# EAGLE design STM32F446 front pane - northwest - v3 (EAGLE 9.6.2)
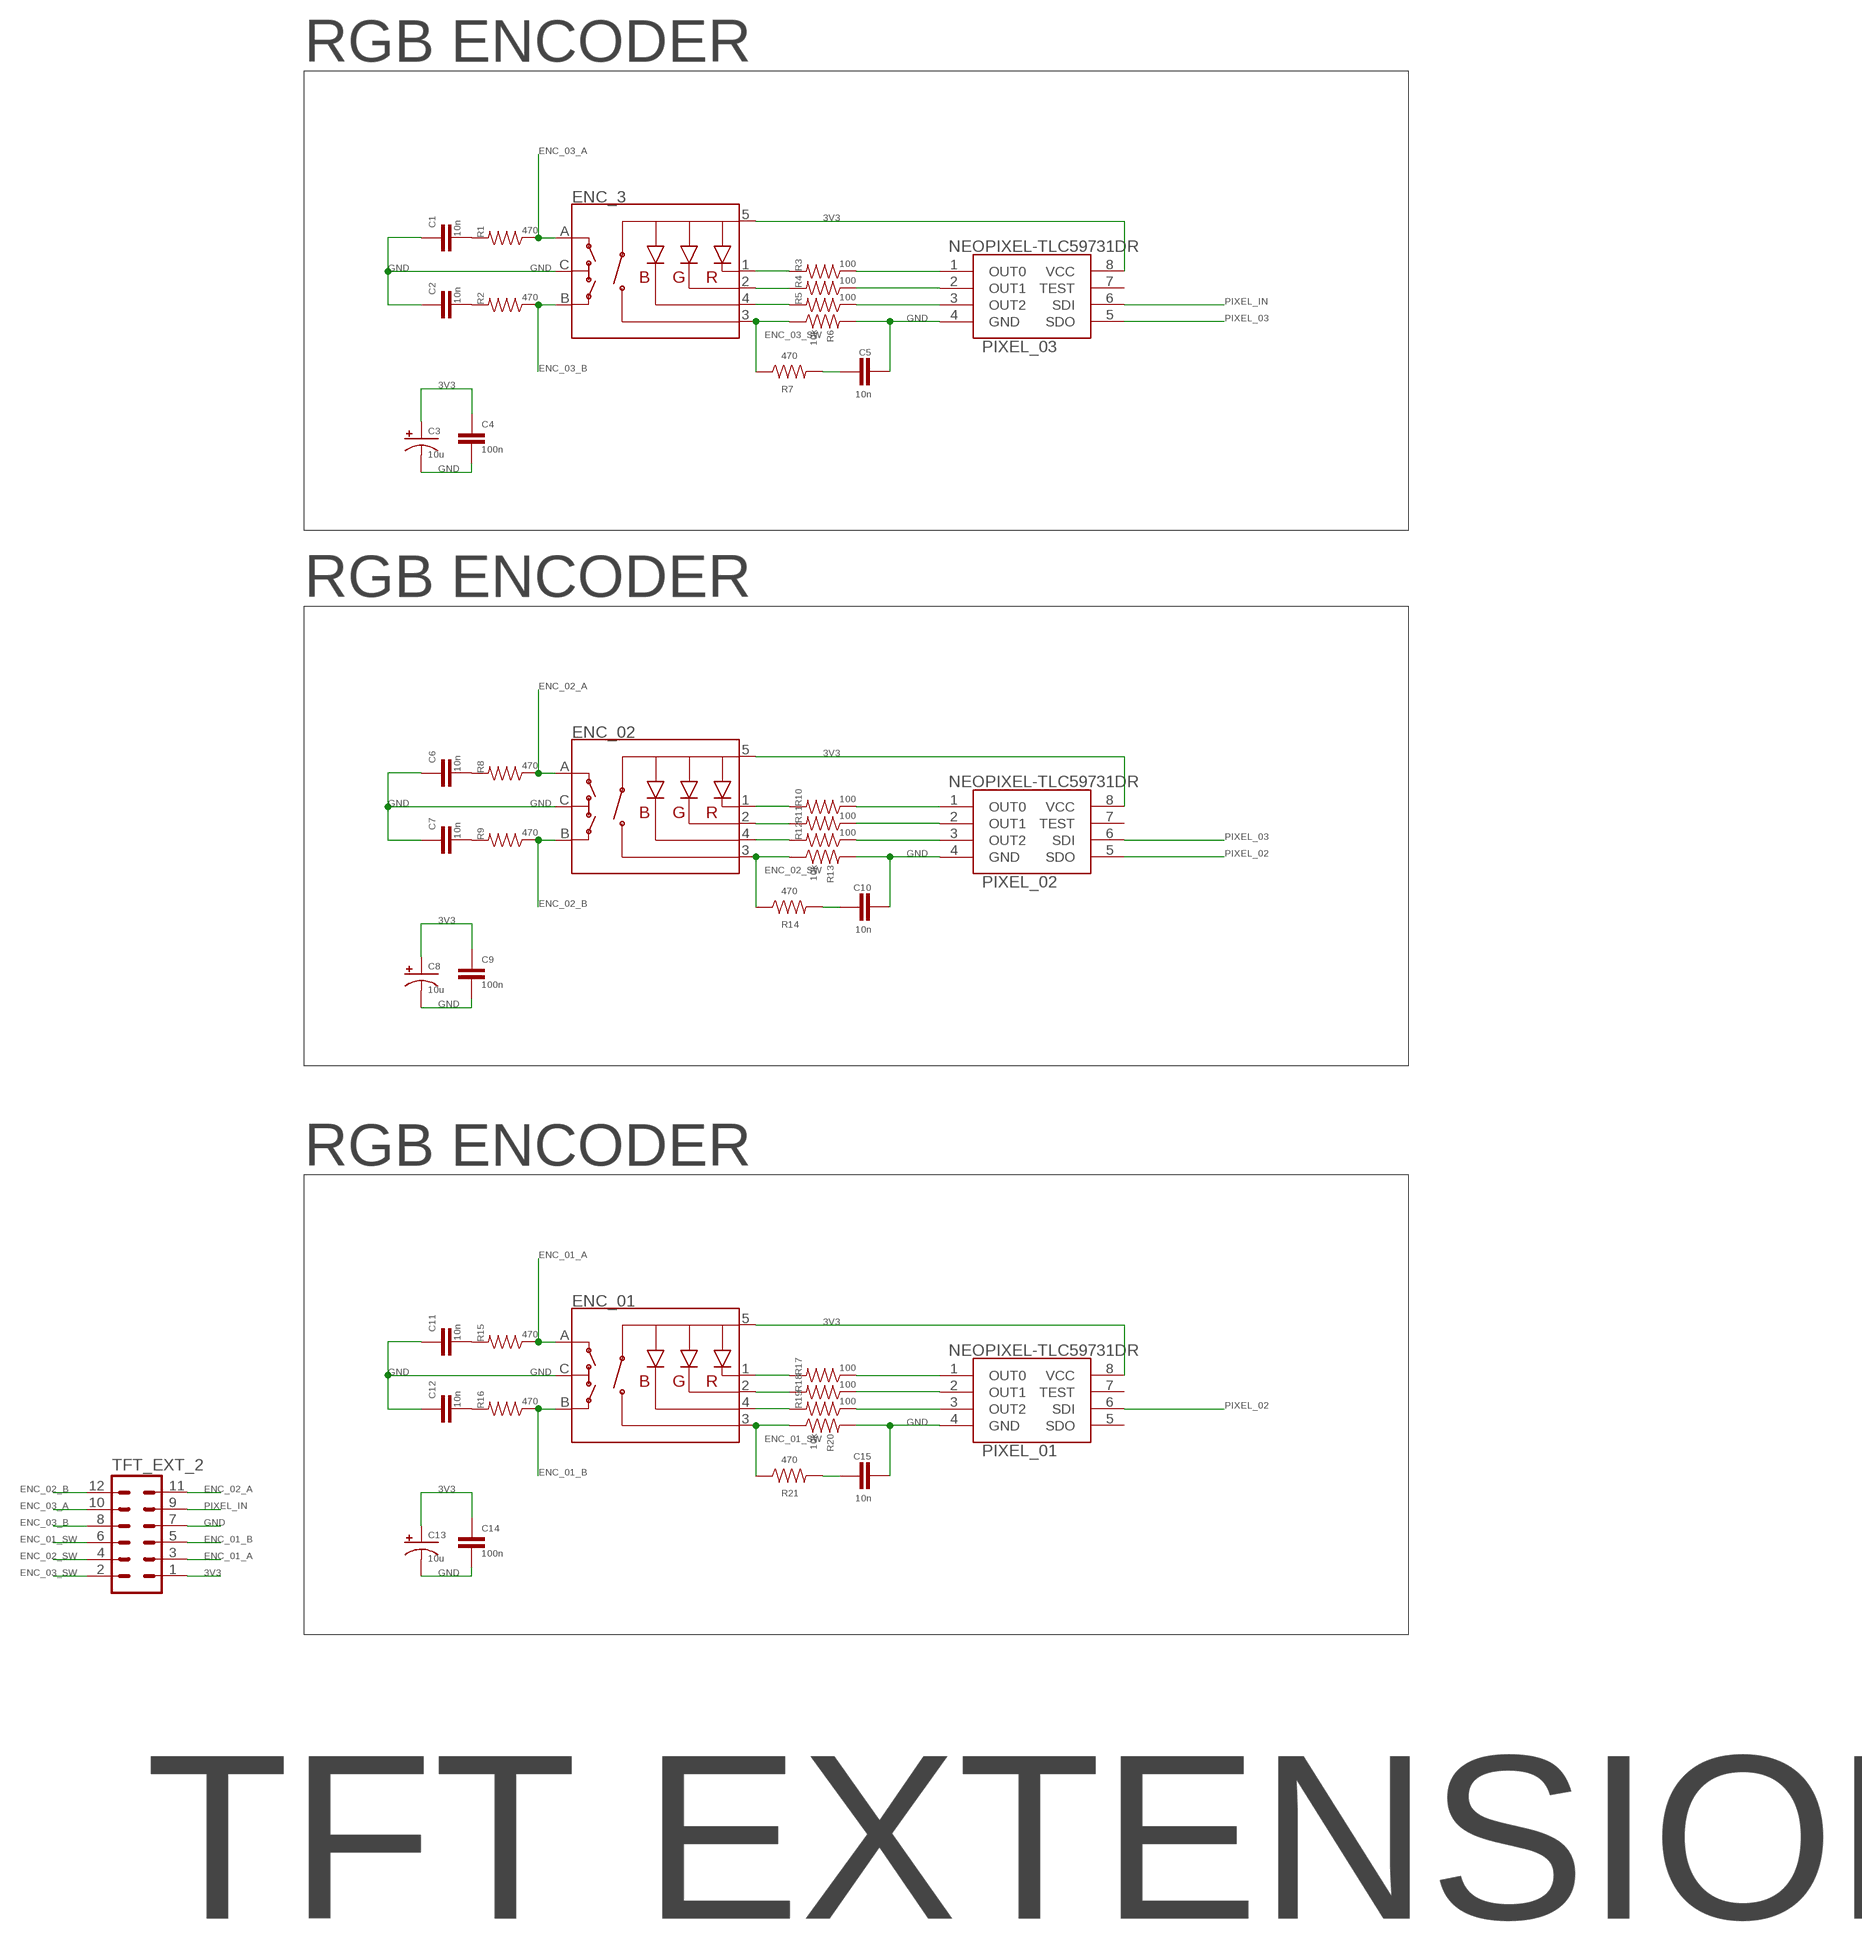
[diagram p0: schematic, sheet 1]

## Parts
C1  10n  PASSIF-CAP-0805  [0805-CAP]
C2  10n  PASSIF-CAP-0805  [0805-CAP]
C3  10u  PASSIF-CPOL-US2917  [CPOL2917]
C4  100n  PASSIF-CAP-0805  [0805-CAP]
C5  10n  PASSIF-CAP-0805  [0805-CAP]
C6  10n  PASSIF-CAP-0805  [0805-CAP]
C7  10n  PASSIF-CAP-0805  [0805-CAP]
C8  10u  PASSIF-CPOL-US2917  [CPOL2917]
C9  100n  PASSIF-CAP-0805  [0805-CAP]
C10  10n  PASSIF-CAP-0805  [0805-CAP]
C11  10n  PASSIF-CAP-0805  [0805-CAP]
C12  10n  PASSIF-CAP-0805  [0805-CAP]
C13  10u  PASSIF-CPOL-US2917  [CPOL2917]
C14  100n  PASSIF-CAP-0805  [0805-CAP]
C15  10n  PASSIF-CAP-0805  [0805-CAP]
ENC_01  ENCODER-RGB-SWITCH-NO_NUT  [ENCODER_LED_3]
ENC_02  ENCODER-RGB-SWITCH-NO_NUT  [ENCODER_LED_3]
ENC_3  ENCODER-RGB-SWITCH-NO_NUT  [ENCODER_LED_3]
PIXEL_01  NEOPIXEL-TLC59731DR  [SOIC127P600X175-8N]
PIXEL_02  NEOPIXEL-TLC59731DR  [SOIC127P600X175-8N]
PIXEL_03  NEOPIXEL-TLC59731DR  [SOIC127P600X175-8N]
R1  470  PASSIF-RESISTOR-1206  [1206]
R2  470  PASSIF-RESISTOR-1206  [1206]
R3  100  PASSIF-RESISTOR-1206  [1206]
R4  100  PASSIF-RESISTOR-1206  [1206]
R5  100  PASSIF-RESISTOR-1206  [1206]
R6  10k  PASSIF-RESISTOR-1206  [1206]
R7  470  PASSIF-RESISTOR-1206  [1206]
R8  470  PASSIF-RESISTOR-1206  [1206]
R9  470  PASSIF-RESISTOR-1206  [1206]
R10  100  PASSIF-RESISTOR-1206  [1206]
R11  100  PASSIF-RESISTOR-1206  [1206]
R12  100  PASSIF-RESISTOR-1206  [1206]
R13  10k  PASSIF-RESISTOR-1206  [1206]
R14  470  PASSIF-RESISTOR-1206  [1206]
R15  470  PASSIF-RESISTOR-1206  [1206]
R16  470  PASSIF-RESISTOR-1206  [1206]
R17  100  PASSIF-RESISTOR-1206  [1206]
R18  100  PASSIF-RESISTOR-1206  [1206]
R19  100  PASSIF-RESISTOR-1206  [1206]
R20  10k  PASSIF-RESISTOR-1206  [1206]
R21  470  PASSIF-RESISTOR-1206  [1206]
TFT_EXT_2  MA06-2  [MA06-2]

## Nets
3V3: C3.+ C4.1 C8.+ C9.1 C13.+ C14.1 ENC_01.5(+) ENC_02.5(+) ENC_3.5(+) PIXEL_01.8(VCC) PIXEL_02.8(VCC) PIXEL_03.8(VCC) TFT_EXT_2.1
ENC_01_A: ENC_01.A R15.1 TFT_EXT_2.3
ENC_01_B: ENC_01.B R16.1 TFT_EXT_2.5
ENC_01_SW: ENC_01.3(SW) R20.1 R21.1 TFT_EXT_2.6
ENC_02_A: ENC_02.A R8.1 TFT_EXT_2.11
ENC_02_B: ENC_02.B R9.1 TFT_EXT_2.12
ENC_02_SW: ENC_02.3(SW) R13.1 R14.1 TFT_EXT_2.4
ENC_03_A: ENC_3.A R1.1 TFT_EXT_2.10
ENC_03_B: ENC_3.B R2.1 TFT_EXT_2.8
ENC_03_SW: ENC_3.3(SW) R6.1 R7.1 TFT_EXT_2.2
GND: C1.1 C2.1 C3.- C4.2 C5.2 C6.1 C7.1 C8.- C9.2 C10.2 C11.1 C12.1 C13.- C14.2 C15.2 ENC_01.C ENC_02.C ENC_3.C PIXEL_01.4(GND) PIXEL_02.4(GND) PIXEL_03.4(GND) R6.2 R13.2 R20.2 TFT_EXT_2.7
N$9808: ENC_01.1(-R) R17.2
N$9809: ENC_01.2(-G) R18.2
N$9810: ENC_01.4(-B) R19.2
N$9811: PIXEL_01.1(OUT0) R17.1
N$9812: PIXEL_01.2(OUT1) R18.1
N$9813: PIXEL_01.3(OUT2) R19.1
N$9814: C11.2 R15.2
N$9815: C12.2 R16.2
N$9816: C15.1 R21.2
N$10174: ENC_02.1(-R) R10.2
N$10175: ENC_02.2(-G) R11.2
N$10176: ENC_02.4(-B) R12.2
N$10177: PIXEL_02.1(OUT0) R10.1
N$10178: PIXEL_02.2(OUT1) R11.1
N$10179: PIXEL_02.3(OUT2) R12.1
N$10180: C6.2 R8.2
N$10181: C7.2 R9.2
N$10182: C10.1 R14.2
N$10540: ENC_3.1(-R) R3.2
N$10541: ENC_3.2(-G) R4.2
N$10542: ENC_3.4(-B) R5.2
N$10543: PIXEL_03.1(OUT0) R3.1
N$10544: PIXEL_03.2(OUT1) R4.1
N$10545: PIXEL_03.3(OUT2) R5.1
N$10546: C1.2 R1.2
N$10547: C2.2 R2.2
N$10548: C5.1 R7.2
PIXEL_02: PIXEL_01.6(SDI) PIXEL_02.5(SDO)
PIXEL_03: PIXEL_02.6(SDI) PIXEL_03.5(SDO)
PIXEL_IN: PIXEL_03.6(SDI) TFT_EXT_2.9
Unconnected: PIXEL_01.5(SDO) PIXEL_01.7(TEST) PIXEL_02.7(TEST) PIXEL_03.7(TEST)

## Notes on the sheet
- RGB ENCODER
- RGB ENCODER
- RGB ENCODER
- TFT EXTENSION

## Library data of the parts
C1 C2 C4-C7 C9-C12 C14 C15 = stock-perso:PASSIF-CAP
C3 C8 C13 = stock-perso:PASSIF-CPOL-US: SMT Tantalum Capacitor; MOUSER: 581-TPSE477K010R0200
ENC_01 ENC_02 ENC_3 = stock-perso:ENCODER-RGB-SWITCH: Illuminated Rotary Encoder w/ RGB LED and select switch Encoders rotate similarly to potentiometers, but they’re different from potentiometers in that an encoder has full rotation without limits. They output gray code so that you can tell how much and in which direction the encoder has been turned. This encoder includes an RGB LED and a push-down select switch. Part #: Top Up EC12PLRGBSDVBF-D <http://top-up.so-buy.com/front/bin/ptdetail.phtml?Part=EC12PLRGBSDVBF-D> SparkFun Products Rotary Encoder - Illuminated (RGB) <https://www.sparkfun.com/products/10982> (COM-10982); PROD_ID: RES-14168
PIXEL_01-PIXEL_03 = stock-perso:NEOPIXEL-TLC59731DR: 3-Channel, 8-Bit, PWM LED Driver with Single-Wire Interface (similaire à du neopixel) Source: Datasheet <http://www.ti.com/lit/gpn/tlc59731>; ARROW_PART_NUMBER: TLC59731DR; ARROW_PRICE-STOCK: https://www.arrow.com/en/products/tlc59731dr/texas-instruments; DESCRIPTION: 3-Channel, 8-Bit, PWM LED Driver with Single-Wire Interface; HEIGHT: 1.75mm; MANUFACTURER_NAME: Texas Instruments; MANUFACTURER_PART_NUMBER: TLC59731DR; MOUSER_PART_NUMBER: 595-TLC59731DR; MOUSER_PRICE-STOCK: https://www.mouser.co.uk/ProductDetail/Texas-Instruments/TLC59731DR?qs=s44pgLhgXQgiW%2FpyLmUsDA%3D%3D
R1-R21 = stock-perso:PASSIF-RESISTOR
TFT_EXT_2 = con-lstb:MA06-2: PIN HEADER; OC_FARNELL: unknown; OC_NEWARK: unknown

## Board
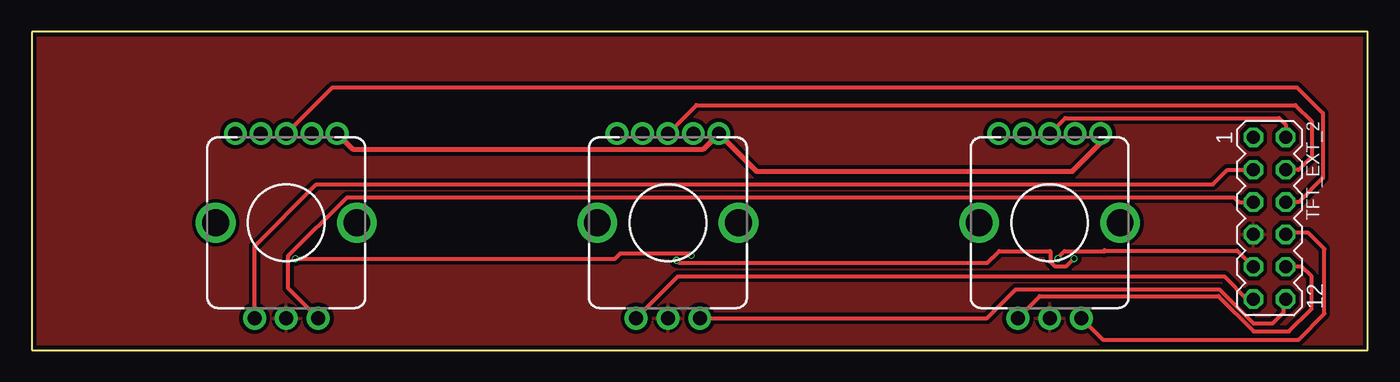
[diagram p1: board, top side]
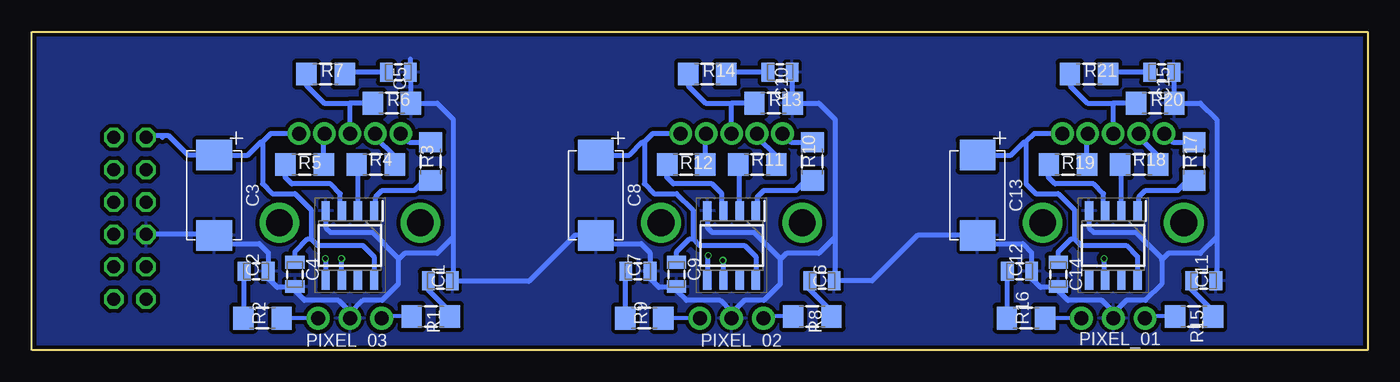
[diagram p2: board, bottom side, seen from below]

Size 105 x 25 mm. Coordinates in mm from the lower left corner, seen from the top.
Outline: 0,0 105,0 105,25 0,25 0,0
Copper layers (1*16): Top 0.035559375mm / dielectric 1.6mm / Bottom 0.035559375mm
Design rules "jlcpcb2layer": minimum track width 5mil, minimum drill 12mil, track to track 5mil, track to pad 5mil, pad to pad 5mil, via to via 5mil, smd to smd 5mil, copper to edge 8mil, drill to drill 6mil, minimum pad ring 5mil, minimum via ring 3mil, stop-mask expansion 2.5mil, vias tented up to drill 0mil, thermal gap 10mil

### Footprints (pad centres in the part's own frame; a part is rotated, then mirrored left to right if it is on the bottom)
0805-CAP = smd 1 x 1.5: 1 -0.95,0; 2 0.95,0
CPOL2917 = smd 2.4 x 2.8: + -3.15,0; - 3.15,0
ENCODER_LED_3 = drill 1.1 pad 1.778: 1 -4,7; 2 -2,7; 3 0,7; 4 2,7; 5 4,7 | drill 1.1 pad 1.8: A -2.5,-7.5; B 2.5,-7.5; C 0,-7.5 | drill 2.1: M1 -5.55,0; M2 5.55,0
SOIC127P600X175-8N = smd 1.528 x 0.65: 1 -2.711,1.905; 2 -2.711,0.635; 3 -2.711,-0.635; 4 -2.711,-1.905; 5 2.711,-1.905; 6 2.711,-0.635; 7 2.711,0.635; 8 2.711,1.905
1206 = smd 1.6 x 1.8: 1 -1.5,0; 2 1.5,0
MA06-2 = drill 1.016 octagon: 1 -6.35,-1.27; 2 -6.35,1.27; 3 -3.81,-1.27; 4 -3.81,1.27; 5 -1.27,-1.27; 6 -1.27,1.27; 7 1.27,-1.27; 8 1.27,1.27; 9 3.81,-1.27; 10 3.81,1.27; 11 6.35,-1.27; 12 6.35,1.27

### Placement (x,y rotation side)
C1  72.89,5.43 180 bottom
C2  87.37,6.19 180 bottom
C3  90.67,12.16 270 bottom
C4  84.32,5.94 270 bottom
C5  76.19,21.81 0 bottom
C6  42.89,5.43 180 bottom
C7  57.37,6.19 180 bottom
C8  60.67,12.16 270 bottom
C9  54.32,5.94 270 bottom
C10  46.19,21.81 0 bottom
C11  12.89,5.43 180 bottom
C12  27.37,6.19 180 bottom
C13  30.67,12.16 270 bottom
C14  24.32,5.94 270 bottom
C15  16.19,21.81 0 bottom
ENC_01  20,10 0 top
ENC_02  50,10 0 top
ENC_3  80,10 0 top
PIXEL_01  20,8.22 270 bottom
PIXEL_02  50,8.22 270 bottom
PIXEL_03  80,8.22 270 bottom
R1  73.65,2.63 0 bottom
R2  86.86,2.51 180 bottom
R3  73.65,14.83 90 bottom
R4  77.97,14.57 0 bottom
R5  83.56,14.57 0 bottom
R6  76.7,19.4 0 bottom
R7  81.91,21.68 0 bottom
R8  43.65,2.63 0 bottom
R9  56.86,2.51 180 bottom
R10  43.65,14.83 90 bottom
R11  47.97,14.57 0 bottom
R12  53.56,14.57 0 bottom
R13  46.7,19.4 0 bottom
R14  51.91,21.68 0 bottom
R15  13.65,2.63 0 bottom
R16  26.86,2.51 180 bottom
R17  13.65,14.83 90 bottom
R18  17.97,14.57 0 bottom
R19  23.56,14.57 0 bottom
R20  16.7,19.4 0 bottom
R21  21.91,21.68 0 bottom
TFT_EXT_2  97.29,10.35 270 top

### Tracks (layer width: path | path; a pad name or v marks a point on that pad's centre or on a via)
3V3
  Top 0.406: ENC_3.5 84,16.24 81.79,14.03 56.97,14.03 ENC_02.5 52.78,15.78 25.22,15.78 ENC_01.5
  Bottom 0.406: ENC_01.5 26.21,17 26.86,16.35 | 26.86,16.35 26.86,13.05 26.1,12.29 24.32,12.29 23.05,11.02 23.05,8.73 | 23.05,8.73 22.54,8.22 18.98,8.22 18.09,7.33 PIXEL_01.8 | C14.1 24.32,7.71 23.3,8.73 23.05,8.73 | C13.+ 28.03,15.31 26.98,16.35 26.86,16.35 | ENC_02.5 56.21,17 56.86,16.35 | 56.86,16.35 56.86,13.05 56.1,12.29 54.32,12.29 53.05,11.02 53.05,8.73 | 53.05,8.73 52.54,8.22 48.98,8.22 48.09,7.33 PIXEL_02.8 | C9.1 54.32,7.71 53.3,8.73 53.05,8.73 | C8.+ 58.03,15.31 56.98,16.35 56.86,16.35 | ENC_3.5 86.21,17 86.86,16.35 | 86.86,16.35 86.86,13.05 86.1,12.29 84.32,12.29 83.05,11.02 83.05,8.73 | 83.05,8.73 82.54,8.22 78.98,8.22 78.09,7.33 PIXEL_03.8 | C4.1 84.32,7.71 83.3,8.73 83.05,8.73 | 86.86,16.35 86.98,16.35 88.03,15.31 C3.+ 92.72,15.31 94.24,16.83 94.62,16.83 | 94.62,16.83 94.75,16.7 | 94.62,16.83 95.89,16.83 TFT_EXT_2.1
ENC_01_A
  Top 0.305: ENC_01.A 17.5,8.16 22.36,13.02 92.84,13.02 93.98,14.16 TFT_EXT_2.3
  Bottom 0.305: R15.1 17.37,2.63 ENC_01.A
ENC_01_B
  Top 0.305: ENC_01.B 20.16,4.84 20.16,7.4 24.77,12 94.49,12 94.87,11.62 TFT_EXT_2.5
  Bottom 0.305: ENC_01.B R16.1
ENC_01_SW
  Top 0.305: ENC_01.3 23.64,20.64 99.45,20.64 101.48,18.61 101.48,13.53 99.57,11.62 TFT_EXT_2.6
  Bottom 0.305: R21.1 23.41,20.77
  Bottom 0.406: ENC_01.3 20,19.4 | R20.1 20,19.4 | 20,19.4 22.03,19.4 23.41,20.77
ENC_02_A
  Top 0.305: ENC_02.A 50.78,5.78 93.73,5.78 95.51,4 TFT_EXT_2.11
  Bottom 0.305: R8.1 47.37,2.63 ENC_02.A
ENC_02_B
  Top 0.305: ENC_02.B 75.09,2.5 77.35,4.76 93.35,4.76 96.02,2.1 97.54,2.1 98.41,2.96 98.41,3.85 TFT_EXT_2.12
  Bottom 0.305: ENC_02.B R9.1
ENC_02_SW
  Top 0.305: ENC_02.3 52.24,19.24 99.32,19.24 100.59,17.97 100.59,15.18 99.57,14.16 TFT_EXT_2.4
  Bottom 0.305: R14.1 53.41,20.77
  Bottom 0.406: ENC_02.3 50,19.4 | R13.1 50,19.4 | 50,19.4 52.03,19.4 53.41,20.77
ENC_03_A
  Top 0.305: ENC_3.A 79.23,4.23 93.27,4.23 96.04,1.46 98.81,1.46 100.59,3.24 100.59,5.78 99.83,6.54 TFT_EXT_2.10
  Bottom 0.305: R1.1 77.37,2.63 ENC_3.A
ENC_03_B
  Top 0.305: ENC_3.B 84.17,0.82 99.57,0.82 101.61,2.86 101.61,7.94 100.33,9.21 98.68,9.21 TFT_EXT_2.8
  Bottom 0.305: ENC_3.B R2.1
ENC_03_SW
  Top 0.305: ENC_3.3 81.22,18.22 98.05,18.22 98.56,17.72 TFT_EXT_2.2
  Bottom 0.305: R7.1 83.41,20.77
  Bottom 0.406: ENC_3.3 80,19.4 | R6.1 80,19.4 | 80,19.4 82.03,19.4 83.41,20.77
GND
  Bottom 0.406: PIXEL_01.4 21.91,9.62 21.52,9.24 18.22,9.24 16.19,7.21 16.19,7.08 | 16.19,7.08 16.19,5.17 17.46,3.9 18.98,3.9 20,2.89 ENC_01.C 20,3.02 20.89,3.9 23.56,3.9 24.32,4.67 C14.2 24.38,4.92 25.71,4.92 26.42,5.62 C12.1 26.42,7.65 27.11,8.35 30.01,8.35 C13.- 35.38,9.01 38.96,5.43 C6.1 41.87,5.49 41.87,8.86 | 15.2,20.18 15.2,19.91 | 15.2,19.91 R20.2 13.14,19.4 11.87,18.13 11.87,8.86 | C11.1 11.87,5.49 11.87,8.86 | 11.87,8.86 13.14,7.59 15.68,7.59 16.19,7.08 | C15.2 15.24,19.95 15.2,19.91 | PIXEL_02.4 51.91,9.62 51.52,9.24 48.22,9.24 46.19,7.21 46.19,7.08 | 46.19,7.08 46.19,5.17 47.46,3.9 48.98,3.9 50,2.89 ENC_02.C 50,3.02 50.89,3.9 53.56,3.9 54.32,4.67 C9.2 54.38,4.92 55.72,4.92 56.42,5.62 C7.1 56.42,7.65 57.11,8.35 60.01,8.35 C8.- 62.31,9.01 65.92,5.4 71.78,5.4 71.87,5.49 | 45.2,20.18 45.2,19.91 | 45.2,19.91 R13.2 43.14,19.4 41.87,18.13 41.87,8.86 | 41.87,8.86 43.14,7.59 45.68,7.59 46.19,7.08 | C10.2 45.24,19.95 45.2,19.91 | PIXEL_03.4 81.91,9.62 81.52,9.24 78.22,9.24 76.19,7.21 76.19,7.08 | 76.19,7.08 76.19,5.17 77.46,3.9 78.98,3.9 80,2.89 ENC_3.C 80,3.02 80.89,3.9 83.56,3.9 84.32,4.67 C4.2 84.38,4.92 85.72,4.92 86.42,5.62 C2.1 86.42,7.65 87.11,8.35 90.01,8.35 C3.- 90.74,9.08 TFT_EXT_2.7 | 75.2,20.18 75.2,19.91 | 75.2,19.91 R6.2 73.14,19.4 71.87,18.13 71.87,8.86 | 71.87,5.49 C1.1 | 71.87,8.86 71.87,5.49 | 71.87,8.86 73.14,7.59 75.68,7.59 76.19,7.08 | 75.2,19.91 75.24,19.95 C5.2 75.24,22.85
  pour Top (isolate 0.305): 0,25 105,25 105,0 0,0
  pour Bottom (isolate 0.305): 0,25 105,25 105,0 0,0
N$9808
  Bottom 0.406: ENC_01.1 15.33,16.33 R17.2
N$9809
  Bottom 0.406: ENC_01.2 18,16.76 16.44,15.21 16.44,14.6 R18.2
N$9810
  Bottom 0.406: R19.2 22.06,16.94 ENC_01.4
N$9811
  Bottom 0.406: PIXEL_01.1 17.97,11.06 17.97,12.03 17.46,12.54 14.92,12.54 14.13,13.33 R17.1
N$9812
  Bottom 0.406: PIXEL_01.2 19.37,14.47 R18.1
N$9813
  Bottom 0.406: PIXEL_01.3 20.76,11.06 20.76,12.29 21.52,13.05 24.57,13.05 25.08,13.56 25.08,14.55 R19.1
N$9814
  Bottom 0.305: C11.2 13.84,4.73 | 12.15,3.04 R15.2
  Bottom 0.406: 13.84,4.73 12.15,3.04
N$9815
  Bottom 0.305: C12.2 28.36,6.15
  Bottom 0.406: 28.36,6.15 R16.2
N$9816
  Bottom 0.305: 20.28,21.81 R21.2
  Bottom 0.406: C15.1 20.28,21.81
N$10174
  Bottom 0.406: ENC_02.1 45.33,16.33 R10.2
N$10175
  Bottom 0.406: ENC_02.2 48,16.76 46.44,15.21 46.44,14.6 R11.2
N$10176
  Bottom 0.406: R12.2 52.06,16.94 ENC_02.4
N$10177
  Bottom 0.406: PIXEL_02.1 47.97,11.06 47.97,12.03 47.46,12.54 44.92,12.54 44.13,13.33 R10.1
N$10178
  Bottom 0.406: PIXEL_02.2 49.37,14.47 R11.1
N$10179
  Bottom 0.406: PIXEL_02.3 50.76,11.06 50.76,12.29 51.52,13.05 54.57,13.05 55.08,13.56 55.08,14.55 R12.1
N$10180
  Bottom 0.305: C6.2 43.84,4.73 | 42.15,3.04 R8.2
  Bottom 0.406: 43.84,4.73 42.15,3.04
N$10181
  Bottom 0.305: C7.2 58.36,6.15
  Bottom 0.406: 58.36,6.15 R9.2
N$10182
  Bottom 0.305: 50.28,21.81 R14.2
  Bottom 0.406: C10.1 50.28,21.81
N$10540
  Bottom 0.406: ENC_3.1 75.33,16.33 R3.2
N$10541
  Bottom 0.406: ENC_3.2 78,16.76 76.44,15.21 76.44,14.6 R4.2
N$10542
  Bottom 0.406: R5.2 82.06,16.94 ENC_3.4
N$10543
  Bottom 0.406: PIXEL_03.1 77.97,11.06 77.97,12.03 77.46,12.54 74.92,12.54 74.13,13.33 R3.1
N$10544
  Bottom 0.406: PIXEL_03.2 79.36,14.47 R4.1
N$10545
  Bottom 0.406: PIXEL_03.3 80.76,11.06 80.76,12.29 81.52,13.05 84.57,13.05 85.08,13.56 85.08,14.55 R5.1
N$10546
  Bottom 0.305: C1.2 73.84,4.73 | 72.15,3.04 R1.2
  Bottom 0.406: 73.84,4.73 72.15,3.04
N$10547
  Bottom 0.305: C2.2 88.36,6.15
  Bottom 0.406: 88.36,6.15 R2.2
N$10548
  Bottom 0.305: 80.28,21.81 R7.2
  Bottom 0.406: C5.1 80.28,21.81
PIXEL_02  (via drill 0.35)
  Top 0.305: v20.71,7.17 45.85,7.17 46.27,7.59 51.66,7.59 v51.82,7.43
  Bottom 0.406: PIXEL_01.6 20.71,5.58 v20.71,7.17 | v51.82,7.43 51.91,7.34 PIXEL_02.5
PIXEL_03  (via drill 0.35)
  Top 0.305: v50.68,7.05 50.89,6.84 75.1,6.84 76.04,7.77 80.06,7.77 80.06,6.93 80.4,6.58 81.33,6.58 v81.92,7.17
  Bottom 0.406: PIXEL_02.6 50.63,7 v50.68,7.05 | v81.92,7.17 81.92,5.53 PIXEL_03.5
PIXEL_IN  (via drill 0.35)
  Top 0.305: 84.29,7.77 81.17,7.77 80.65,7.25 v80.65,7.17 | 84.33,7.81 94.75,7.81 TFT_EXT_2.9
  Top 0.406: 84.29,7.77 84.33,7.81
  Bottom 0.406: PIXEL_03.6 80.64,7.16 v80.65,7.17

### Text on the board
Document: Param1 | Param2 | Param3